# Altium schematic sheet VUE_PIC32_v1_0_PIC32.SchDoc: [VUE32 - PIC32]
size A4; Engineer: JFDuval; Revision: 1.0
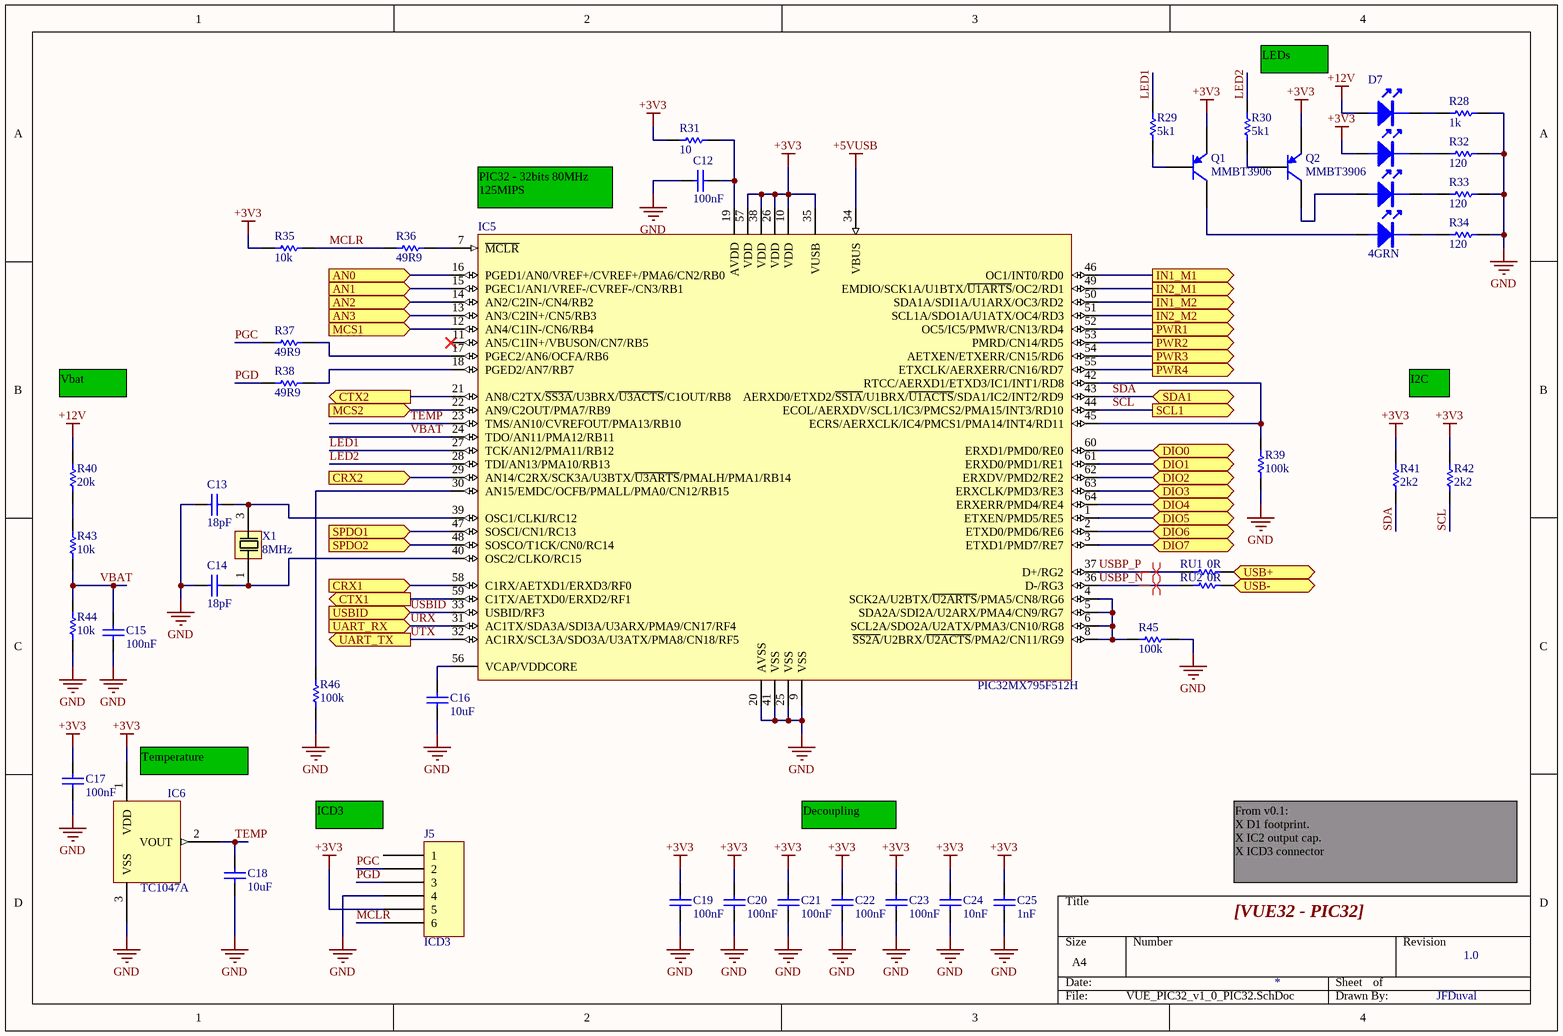
[diagram p0: VUE_PIC32_v1_0_PIC32.SchDoc]

## Parts
C12  100nF  [0402C]
C13  18pF  [0402C]
C14  18pF  [0402C]
C15  100nF  [0402C]
C16  10uF  [0805C]
C17  100nF  [0402C]
C18  10uF  [0805C]
C19  100nF  [0402C]
C20  100nF  [0402C]
C21  100nF  [0402C]
C22  100nF  [0402C]
C23  100nF  [0402C]
C24  10nF  [0402C]
C25  1nF  [0402C]
D7  4GRN  [KINGBRIGHT_4HIGH_LED]
IC5  PIC32MX795F512H  [TQFP-64]
IC6  TC1047A  [SOT23-3]
J5  ICD3  [HEADER_FEMALE_DUAL_6POS_1_27MM]
Q1  MMBT3906  [SC-75/SOT-416]
Q2  MMBT3906  [SC-75/SOT-416]
R28  value 1k  [0402]  (hidden comment: DNS)
R29  5k1  [0402]
R30  5k1  [0402]
R31  10  [0402]
R32  120  [0402]
R33  120  [0402]
R34  120  [0402]
R35  10k  [0402]
R36  49R9  [0402]
R37  49R9  [0402]
R38  49R9  [0402]
R39  100k  [0402]
R40  20k  [0402]
R41  2k2  [0402]
R42  2k2  [0402]
R43  10k  [0402]
R44  10k  [0402]
R45  100k  [0402]
R46  100k  [0402]
RU1  0R  [0402]
RU2  0R  [0402]
X1  8MHz  [ABBM2]

## Ports
AN0 (in), AN1 (in), AN2 (in), AN3 (in), CRX1 (in), CRX2 (in), CTX1 (out), CTX2 (out), DIO0 (bidir), DIO1 (bidir), DIO2 (bidir), DIO3 (bidir), DIO4 (bidir), DIO5 (bidir), DIO6 (bidir), DIO7 (bidir), IN1_M1 (out), IN1_M2 (out), IN2_M1 (out), IN2_M2 (out), MCS1 (in), MCS2 (in), PWR1 (out), PWR2 (out), PWR3 (out), PWR4 (out), SCL1 (out), SDA1 (bidir), SPDO1 (in), SPDO2 (in), UART_RX (in), UART_TX (out), USB+ (bidir), USB- (bidir), USBID (in)

## Nets
+3V3: C17.1 C19.1 C20.1 C21.1 C22.1 C23.1 C24.2 C25.2 D7.A3 IC5.10(VDD) IC5.26(VDD) IC5.35(VUSB) IC5.38(VDD) IC5.57(VDD) IC6.1(VDD) J5.5 Q1.2(E) Q2.2(E) R31.2 R35.1 R41.2 R42.2
+5VUSB: IC5.34(VBUS)
+12V: D7.A4 R40.2
GND: C12.2 C13.2 C14.2 C15.2 C16.1 C17.2 C18.1 C19.2 C20.2 C21.2 C22.2 C23.2 C24.1 C25.1 IC5.9(VSS) IC5.20(AVSS) IC5.25(VSS) IC5.41(VSS) IC6.3(VSS) J5.4 R28.1 R32.2 R33.2 R34.2 R39.1 R44.1 R45.2 R46.1
AN0: IC5.16(PGED1/AN0/VREF+/CVREF+/PMA6/CN2/RB0) ; port AN0
AN1: IC5.15(PGEC1/AN1/VREF-/CVREF-/CN3/RB1) ; port AN1
AN2: IC5.14(AN2/C2IN-/CN4/RB2) ; port AN2
AN3: IC5.13(AN3/C2IN+/CN5/RB3) ; port AN3
CRX1: IC5.58(C1RX/AETXD1/ERXD3/RF0) ; port CRX1
CRX2: IC5.29(AN14/C2RX/SCK3A/U3BTX/~{U3ARTS}/PMALH/PMA1/RB14) ; port CRX2
CTX1: IC5.59(C1TX/AETXD0/ERXD2/RF1) ; port CTX1
CTX2: IC5.21(AN8/C2TX/~{SS3A}/U3BRX/~{U3ACTS}/C1OUT/RB8) ; port CTX2
DIO0: IC5.60(ERXD1/PMD0/RE0) ; port DIO0
DIO1: IC5.61(ERXD0/PMD1/RE1) ; port DIO1
DIO2: IC5.62(ERXDV/PMD2/RE2) ; port DIO2
DIO3: IC5.63(ERXCLK/PMD3/RE3) ; port DIO3
DIO4: IC5.64(ERXERR/PMD4/RE4) ; port DIO4
DIO5: IC5.1(ETXEN/PMD5/RE5) ; port DIO5
DIO6: IC5.2(ETXD0/PMD6/RE6) ; port DIO6
DIO7: IC5.3(ETXD1/PMD7/RE7) ; port DIO7
IN1_M1: IC5.46(OC1/INT0/RD0) ; port IN1_M1
IN1_M2: IC5.50(SDA1A/SDI1A/U1ARX/OC3/RD2) ; port IN1_M2
IN2_M1: IC5.49(EMDIO/SCK1A/U1BTX/~{U1ARTS}/OC2/RD1) ; port IN2_M1
IN2_M2: IC5.51(SCL1A/SDO1A/U1ATX/OC4/RD3) ; port IN2_M2
LED1: IC5.27(TCK/AN12/PMA11/RB12) R29.2
LED2: IC5.28(TDI/AN13/PMA10/RB13) R30.2
MCLR: J5.6 R35.2 R36.1
MCS1: IC5.12(AN4/C1IN-/CN6/RB4) ; port MCS1
MCS2: IC5.22(AN9/C2OUT/PMA7/RB9) ; port MCS2
PGC: J5.2 R37.1
PGD: J5.3 R38.1
PWR1: IC5.52(OC5/IC5/PMWR/CN13/RD4) ; port PWR1
PWR2: IC5.53(PMRD/CN14/RD5) ; port PWR2
PWR3: IC5.54(AETXEN/ETXERR/CN15/RD6) ; port PWR3
PWR4: IC5.55(ETXCLK/AERXERR/CN16/RD7) ; port PWR4
SCL: IC5.44(ECOL/AERXDV/SCL1/IC3/PMCS2/PMA15/INT3/RD10) R42.1 ; port SCL1
SDA: IC5.43(AERXD0/ETXD2/~{SS1A}/U1BRX/~{U1ACTS}/SDA1/IC2/INT2/RD9) R41.1 ; port SDA1
SPDO1: IC5.47(SOSCI/CN1/RC13) ; port SPDO1
SPDO2: IC5.48(SOSCO/T1CK/CN0/RC14) ; port SPDO2
TEMP: C18.2 IC5.23(TMS/AN10/CVREFOUT/PMA13/RB10) IC6.2(VOUT)
URX: IC5.31(AC1TX/SDA3A/SDI3A/U3ARX/PMA9/CN17/RF4) ; port UART_RX
USB+: RU1.2 ; port USB+
USB-: RU2.2 ; port USB-
USBID: IC5.33(USBID/RF3) ; port USBID
USBP_N: IC5.36(D-/RG3) RU2.1
USBP_P: IC5.37(D+/RG2) RU1.1
UTX: IC5.32(AC1RX/SCL3A/SDO3A/U3ATX/PMA8/CN18/RF5) ; port UART_TX
VBAT: C15.1 IC5.24(TDO/AN11/PMA12/RB11) R43.1 R44.2
NetC12_1: C12.1 IC5.19(AVDD) R31.1
NetC13_1: C13.1 IC5.39(OSC1/CLKI/RC12) X1.3(B)
NetC14_1: C14.1 IC5.40(OSC2/CLKO/RC15) X1.1(A)
NetC16_2: C16.2 IC5.56(VCAP/VDDCORE)
NetD7_A1: D7.A1 Q1.3(C)
NetD7_A2: D7.A2 Q2.3(C)
NetD7_C1: D7.C1 R34.1
NetD7_C2: D7.C2 R33.1
NetD7_C3: D7.C3 R32.1
NetD7_C4: D7.C4 R28.2
NetIC5_4: IC5.4(SCK2A/U2BTX/~{U2ARTS}/PMA5/CN8/RG6) IC5.5(SDA2A/SDI2A/U2ARX/PMA4/CN9/RG7) IC5.6(SCL2A/SDO2A/U2ATX/PMA3/CN10/RG8) IC5.8(~{SS2A}/U2BRX/~{U2ACTS}/PMA2/CN11/RG9) R45.1
NetIC5_7: IC5.7(~{MCLR}) R36.2
NetIC5_17: IC5.17(PGEC2/AN6/OCFA/RB6) R37.2
NetIC5_18: IC5.18(PGED2/AN7/RB7) R38.2
NetIC5_30: IC5.30(AN15/EMDC/OCFB/PMALL/PMA0/CN12/RB15) R46.2
NetIC5_42: IC5.42(RTCC/AERXD1/ETXD3/IC1/INT1/RD8) IC5.45(ECRS/AERXCLK/IC4/PMCS1/PMA14/INT4/RD11) R39.2
NetQ1_1: Q1.1(B) R29.1
NetQ2_1: Q2.1(B) R30.1
NetR40_1: R40.1 R43.2

Not connected (* = marked no-connect by the designer): IC5 11(AN5/C1IN+/VBUSON/CN7/RB5)*; J5 1

## Layout directives
differential pair: USBP_N, USBP_P

## Notes on the sheet
- LEDs
- (near IC5) PIC32 - 32bits 80MHz 125MIPS
- Vbat
- I2C
- (near IC6) Temperature
- (near J5) ICD3
- Decoupling
- From v0.1:
  X D1 footprint.
  X IC2 output cap.
  X ICD3 connector

## Library data of the parts
C12 C15 C17 C19-C23 = CAP_TDK_C_0402_100nF_25V: CAP CER 0.1UF 25V Y5V 0402; MfgPartNumber: C1005Y5V1E104Z; Mfg: TDK; Value: 100nF; Digikey: 445-3445-1-ND
C13 C14 = CAP_TDK_C_0402_18pF_50V: CAP CER 18PF 50V 5% NP0 0402; MfgPartNumber: C1005C0G1H180J; Mfg: TDK; Value: 18pF; Digikey: 445-1238-1-ND
C16 C18 = CAP_MURATA_C_0805_10uF_16V: CAP CER 10UF 16V Y5V 0805; MfgPartNumber: GRM21BF51C106ZE15L; Mfg: Murata; Digikey: 490-3347-1-ND; Value: 10uF
C24 = CAP_TDK_C_0402_10nF_25V: CAP CER 10000PF 25V 10% X7R 0402; MfgPartNumber: C1005X7R1E103K; Mfg: TDK; Value: 10nF; Digikey: 445-1260-1-ND
C25 = CAP_TDK_C_0402_1nF_25V: CAP CER 1000PF 25V 10% X7R 0402; MfgPartNumber: C1005X7R1E102K; Mfg: TDK; Value: 1nF; Digikey: 445-4924-1-ND
D7 = LED_KINGBRIGHT_4HIGH_GREEN: LED IND 2X3MM QUAD RA GRN DIFF; MfgPartNumber: WP914CK/4GDT; Mfg: Kingbright Corp; Digikey: 754-1286-ND; Value: 4GRN
IC5 = IC_MCU_MICROCHIP_PIC32MX795F512H: IC MCU 32BIT 512KB FLASH 64TQFP; MfgPartNumber: PIC32MX795F512H-80I/PT; Mfg: Microchip Technology; Value: PIC32MX795F512H; Digikey: PIC32MX795F512H-80I/PT-ND
IC6 = IC_SENSOR_MICROCHIP_TEMP_TC1047A: IC TEMP-VOLT CONV PREC SOT-23B; MfgPartNumber: TC1047AVNBTR; Mfg: Microchip Technology; Value: TC1047A; Digikey: TC1047AVNBCT-ND
J5 = CON_SULLINS_HEADER_F_3X2_6POS_1_27MM: CONN HEADER .050" 6POS DL PCB AU; MfgPartNumber: LPPB032CFFN-RC; Mfg: Sullins Connector Solutions; Value: HF3X2; Digikey: S9009E-03-ND
Q1 Q2 = BJT_ONSEMI_PNP_MMBT3906_40V_200MA_SC75: TRANS PNP GP 40V 200MA SC75-3; MfgPartNumber: MMBT3906TT1G; Mfg: ON Semiconductor; Digikey: MMBT3906TT1GOSCT-ND; Value: MMBT3906
R28 = RES_YAGEO_0402_1K_1PCT: RES 1.00K OHM 1/16W 1% 0402 SMD; MfgPartNumber: RC0402FR-071KL; Mfg: Yageo; Digikey: 311-1.00KLRCT-ND
R29 R30 = RES_YAGEO_0402_5K1_1PCT: RES 5.10K OHM 1/16W 1% 0402 SMD; MfgPartNumber: RC0402FR-075K1L; Mfg: Yageo; Digikey: 311-5.10KLRCT-ND; Value: 5k1
R31 = RES_YAGEO_0402_10_1PCT: RES 10.0 OHM 1/16W 1% 0402 SMD; MfgPartNumber: RC0402FR-0710RL; Mfg: Yageo; Value: 10; Digikey: 311-10.0LRCT-ND
R32-R34 = RES_YAGEO_0402_120_1PCT: RES 120 OHM 1/16W 1% 0402 SMD; MfgPartNumber: RC0402FR-07120RL; Mfg: Yageo; Value: 120; Digikey: 311-120LRCT-ND
R35 R43 R44 = RES_YAGEO_0402_10K_1PCT: RES 10.0K OHM 1/16W 1% 0402 SMD; MfgPartNumber: RC0402FR-0710KL; Mfg: Yageo; Value: 10k; Digikey: 311-10.0KLRCT-ND
R36-R38 = RES_YAGEO_0402_49R9_1PCT: RES 49.9 OHM 1/16W 1% 0402 SMD; MfgPartNumber: RC0402FR-0749R9L; Mfg: Yageo; Value: 49R9; Digikey: 311-49.9LRCT-ND
R39 R45 R46 = RES_YAGEO_0402_100K_1PCT: RES 100K OHM 1/16W 1% 0402 SMD; MfgPartNumber: RC0402FR-07100KL; Mfg: Yageo; Digikey: 311-100KLRCT-ND; Value: 100k
R40 = RES_YAGEO_0402_20K_1PCT: RES 20.0K OHM 1/16W 1% 0402 SMD; MfgPartNumber: RC0402FR-0720KL; Mfg: Yageo; Digikey: 311-20.0KLRCT-ND; Value: 20k
R41 R42 = RES_YAGEO_0402_2K2_1PCT: RES 2.20K OHM 1/16W 1% 0402 SMD; MfgPartNumber: RC0402FR-072K2L; Mfg: Yageo; Digikey: 311-2.20KLRCT-ND; Value: 2k2
RU1 RU2 = RES_YAGEO_0402_0R_1PCT: RES 0.0 OHM 1/16W 0402 SMD; MfgPartNumber: RC0402JR-070RL; Mfg: Yageo; Digikey: 311-0.0JRCT-ND; Value: 0R
X1 = CRYSTAL_ABRACON_8MHZ_OSC: CRYSTAL 8.000 MHZ 18PF SMD; MfgPartNumber: ABMM2-8.000MHZ-E2-T; Mfg: Abracon Corporation; Value: 8MHz; Digikey: 535-9628-1-ND